# Altium schematic sheet emi_filter_ch1_a.SchDoc: EMI Filter CH1 A
size A4; Date: 2015-10-11; Author: Piotr Kuligowski; Revision: 1-0; SheetTotal: 14; Model: EM1
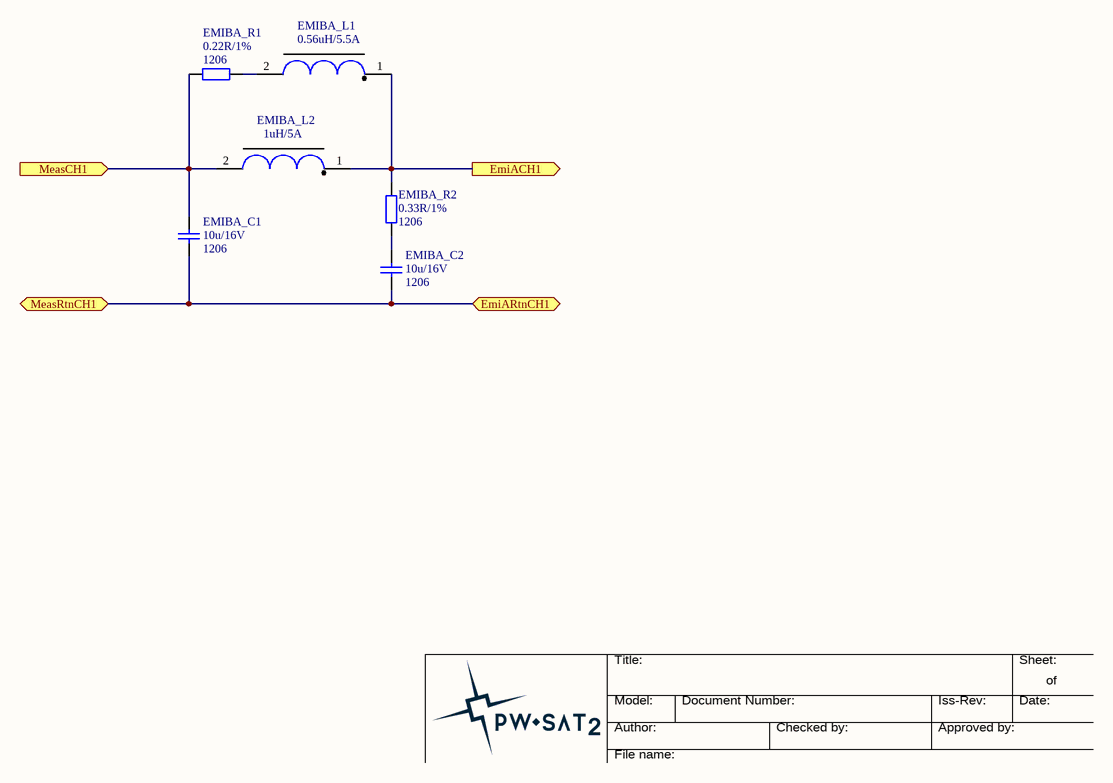
[diagram p0: emi_filter_ch1_a.SchDoc]

## Parts
EMIBA_C1  Packge: 1206  [SMD_Capacitor_1206]  (hidden comment: 10u/16V)
EMIBA_C2  Packge: 1206  [SMD_Capacitor_1206]  (hidden comment: 10u/16V)
EMIBA_L1  0.56uH/5.5A  [Vishay_IHLP1212]
EMIBA_L2  1uH/5A  [Vishay_IHLP1212]
EMIBA_R1  Package: 1206  [SMD_Resistor_1206]  (hidden comment: 0.22R/1%)
EMIBA_R2  Package: 1206  [SMD_Resistor_1206]  (hidden comment: 0.33R/1%)

## Ports
EmiACH1 (out), EmiARtnCH1, MeasCH1 (in), MeasRtnCH1

## Nets
EmiACH1: EMIBA_L1.1 EMIBA_L2.1 EMIBA_R2.2 ; port EmiACH1
EmiARtnCH1: EMIBA_C1.2 EMIBA_C2.2 ; port MeasRtnCH1, port EmiARtnCH1
MeasCH1: EMIBA_C1.1 EMIBA_L2.2 EMIBA_R1.1 ; port MeasCH1
NetEMIBA_C2_1: EMIBA_C2.1 EMIBA_R2.1
NetEMIBA_L1_2: EMIBA_L1.2 EMIBA_R1.2

## Notes on the sheet
- Title:
- Sheet:
- of
- Author:
- Model:
- Document Number:
- Checked by:
- Iss-Rev:
- Approved by:
- Date:
- File name:

## Library data of the parts
EMIBA_C1 EMIBA_C2 = Cer_C1206T106K4RACTU: Ceramic Cap Kemet COTS 10u/16V X7R 1206; ManufacturerPartNumber: C1206T106K4RACTU; Manufacturer: Kemet; Value: 10u/16V
EMIBA_L1 = IHLP1212BZERR56M11: Vishay IHLP1212 Inductor, L=0.56uH, Irise40deg=5.5A, ESR=16mR, SRF=1MHz.; Manufacturer: Vishay; ManufacturerPartNumber: IHLP1212BZERR56M11; Value: 0.56uH/5.5A
EMIBA_L2 = IHLP1212BZER1R0M11: Vishay IHLP1212 Inductor, L=1uH, Irise40deg=5A, ESR=20mR, SRF=1MHz.; Manufacturer: Vishay; ManufacturerPartNumber: IHLP1212BZER1R0M11; Value: 1uH/5A
EMIBA_R1 = ERJ-8BQFR22V: Panasonic Resistor 0.22R 1% 1206 330mW; Manufacturer: Panasonic; ManufacturerPartNumber: ERJ-8BQFR22V; Value: 0.22R/1%
EMIBA_R2 = ERJ-8BQFR33V: Panasonic Resistor 0.33R 1% 1206 330mW; Manufacturer: Panasonic; ManufacturerPartNumber: ERJ-8BQFR33V; Value: 0.33R/1%